# EAGLE design RTI-RoR (EAGLE 7.7.0)
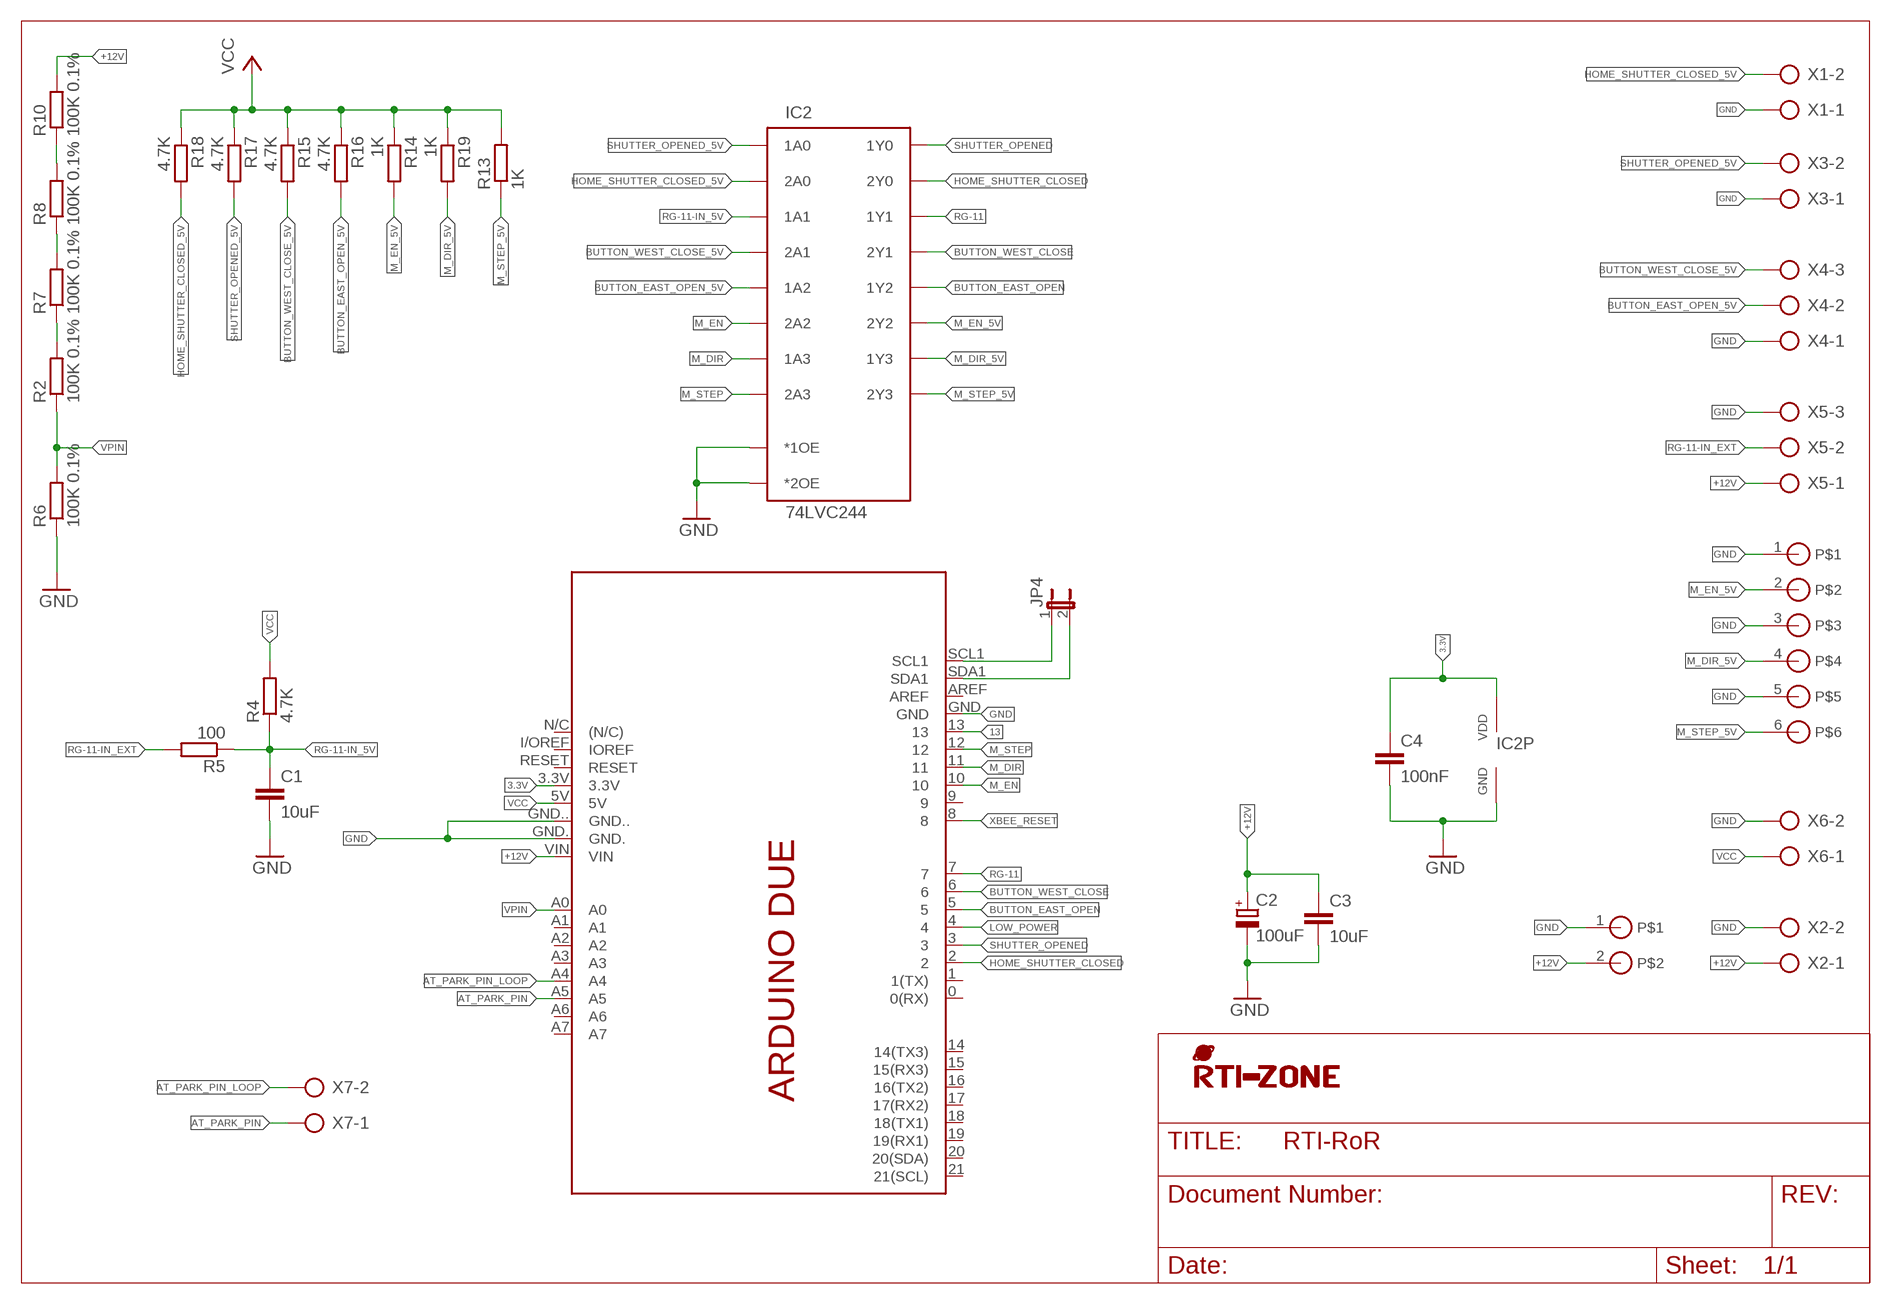
[diagram p0: schematic, sheet 1]

## Parts
C1  10uF  C-EU'0805'  [C0805]
C2  100uF  CPOL-EU  [UD-10X10_NICHICON]
C3  10uF  C-EU'0805'  [C0805]
C4  100nF  C-EU'0805'  [C0805]
IC2  74LVC244  [TSSOP20]
JP4  JP1E  [JP1]
PCB1  ARDUINO_DUE_SHIELD_SHORT  [ARDUINO_DUE_SHIELD_SHORT]
R2  100K 0.1%  R-EU'0805'  [R0805]
R4  4.7K  R-EU'0805'  [R0805]
R5  100  R-EU'0805'  [R0805]
R6  100K 0.1%  R-EU'0805'  [R0805]
R7  100K 0.1%  R-EU'0805'  [R0805]
R8  100K 0.1%  R-EU'0805'  [R0805]
R10  100K 0.1%  R-EU'0805'  [R0805]
R13  1K  R-EU'0805'  [R0805]
R14  1K  R-EU'0805'  [R0805]
R15  4.7K  R-EU'0805'  [R0805]
R16  4.7K  R-EU'0805'  [R0805]
R17  4.7K  R-EU'0805'  [R0805]
R18  4.7K  R-EU'0805'  [R0805]
R19  1K  R-EU'0805'  [R0805]
U$2  STL-140-2  [STL-140-2]
U$3  STL-140-6  [STL-140-6]
U$4  RTI-LOGO_BIG  [LOGO_BIG]
X1  AK500/2  [AK500/2]
X2  AK500/2  [AK500/2]
X3  AK500/2  [AK500/2]
X4  AK500/3  [AK500/3]
X5  AK500/3  [AK500/3]
X6  AK500/2  [AK500/2]
X7  AK500/2  [AK500/2]

## Nets
3.3V: C4.1 IC2.P$20(VDD) PCB1.3.3V
13: PCB1.13
+12V [+12V]: C2.+ C3.1 PCB1.VIN R10.2 U$2.2 X2.1 X5.1
AT_PARK_PIN: PCB1.A5 X7.1
AT_PARK_PIN_LOOP: PCB1.A4 X7.2
BUTTON_EAST_OPEN: IC2.P$14(1Y2) PCB1.5
BUTTON_EAST_OPEN_5V: IC2.P$6(1A2) R16.2 X4.2
BUTTON_WEST_CLOSE: IC2.P$5(2Y1) PCB1.6
BUTTON_WEST_CLOSE_5V: IC2.P$15(2A1) R15.2 X4.3
GND [GND]: C1.2 C2.- C3.2 C4.2 IC2.P$1(*1OE) IC2.P$10(GND) IC2.P$19(*2OE) PCB1.GND PCB1.GND. PCB1.GND.. R6.1 U$2.1 U$3.1 U$3.3 U$3.5 X1.1 X2.2 X3.1 X4.1 X5.3 X6.2
HOME_SHUTTER_CLOSED: IC2.P$3(2Y0) PCB1.2
HOME_SHUTTER_CLOSED_5V: IC2.P$17(2A0) R18.2 X1.2
LOW_POWER: PCB1.4
M_DIR: IC2.P$8(1A3) PCB1.11
M_DIR_5V: IC2.P$12(1Y3) R19.2 U$3.4
M_EN: IC2.P$13(2A2) PCB1.10
M_EN_5V: IC2.P$7(2Y2) R14.2 U$3.2
M_STEP: IC2.P$11(2A3) PCB1.12
M_STEP_5V: IC2.P$9(2Y3) R13.1 U$3.6
N$2: R7.2 R8.1
N$3: R8.2 R10.1
N$5: R2.2 R7.1
N$6: JP4.1 PCB1.SCL1
N$8: JP4.2 PCB1.SDA1
RG-11: IC2.P$16(1Y1) PCB1.7
RG-11-IN_5V: C1.1 IC2.P$4(1A1) R4.1 R5.1
RG-11-IN_EXT: R5.2 X5.2
SHUTTER_OPENED: IC2.P$18(1Y0) PCB1.3
SHUTTER_OPENED_5V: IC2.P$2(1A0) R17.2 X3.2
VCC: PCB1.5V R4.2 R13.2 R14.1 R15.1 R16.1 R17.1 R18.1 R19.1 X6.1
VPIN: PCB1.A0 R2.1 R6.2
XBEE_RESET: PCB1.8
Unconnected: PCB1.0(0(RX)) PCB1.1(1(TX)) PCB1.9 PCB1.14(14(TX3)) PCB1.15(15(RX3)) PCB1.16(16(TX2)) PCB1.17(17(RX2)) PCB1.18(18(TX1)) PCB1.19(19(RX1)) PCB1.20(20(SDA)) PCB1.21(21(SCL)) PCB1.A1 PCB1.A2 PCB1.A3 PCB1.A6 PCB1.A7 PCB1.AREF PCB1.I/OREF(IOREF) PCB1.N/C((N/C)) PCB1.RESET

## Library data of the parts
C1 C3 C4 = rti:C-EU
C2 = rti:CPOL-EU
IC2 = rti:74*244
JP4 = jumper:JP1E: JUMPER
PCB1 = arduino_shield:ARDUINO_DUE_SHIELD_SHORT: Device for representing an Arduino Due board with a footprint in an EAGLE design. Created by Dave Young for Element14. More EAGLE documentation at: http://www.element14.com/community/community/knode/cadsoft_eagle
R2 R4-R8 R10 R13-R19 = rti:R-EU
U$2 = rti:STL-140-2
U$3 = rti:STL-140-6
U$4 = rti:RTI-LOGO
X1-X3 X6 X7 = con-ptr500:AK500/2: CONNECTOR; OC_FARNELL: unknown; OC_NEWARK: unknown
X4 X5 = con-ptr500:AK500/3: CONNECTOR; OC_FARNELL: unknown; OC_NEWARK: unknown

## Net classes
0 default: width 0.254 mm, drill 0.3 mm, clearance 0.203 mm
1 +12V: width 0.254 mm, drill 0.3 mm, clearance 0.203 mm
2 GND: width 0.254 mm, drill 0.3 mm, clearance 0.203 mm

## Board
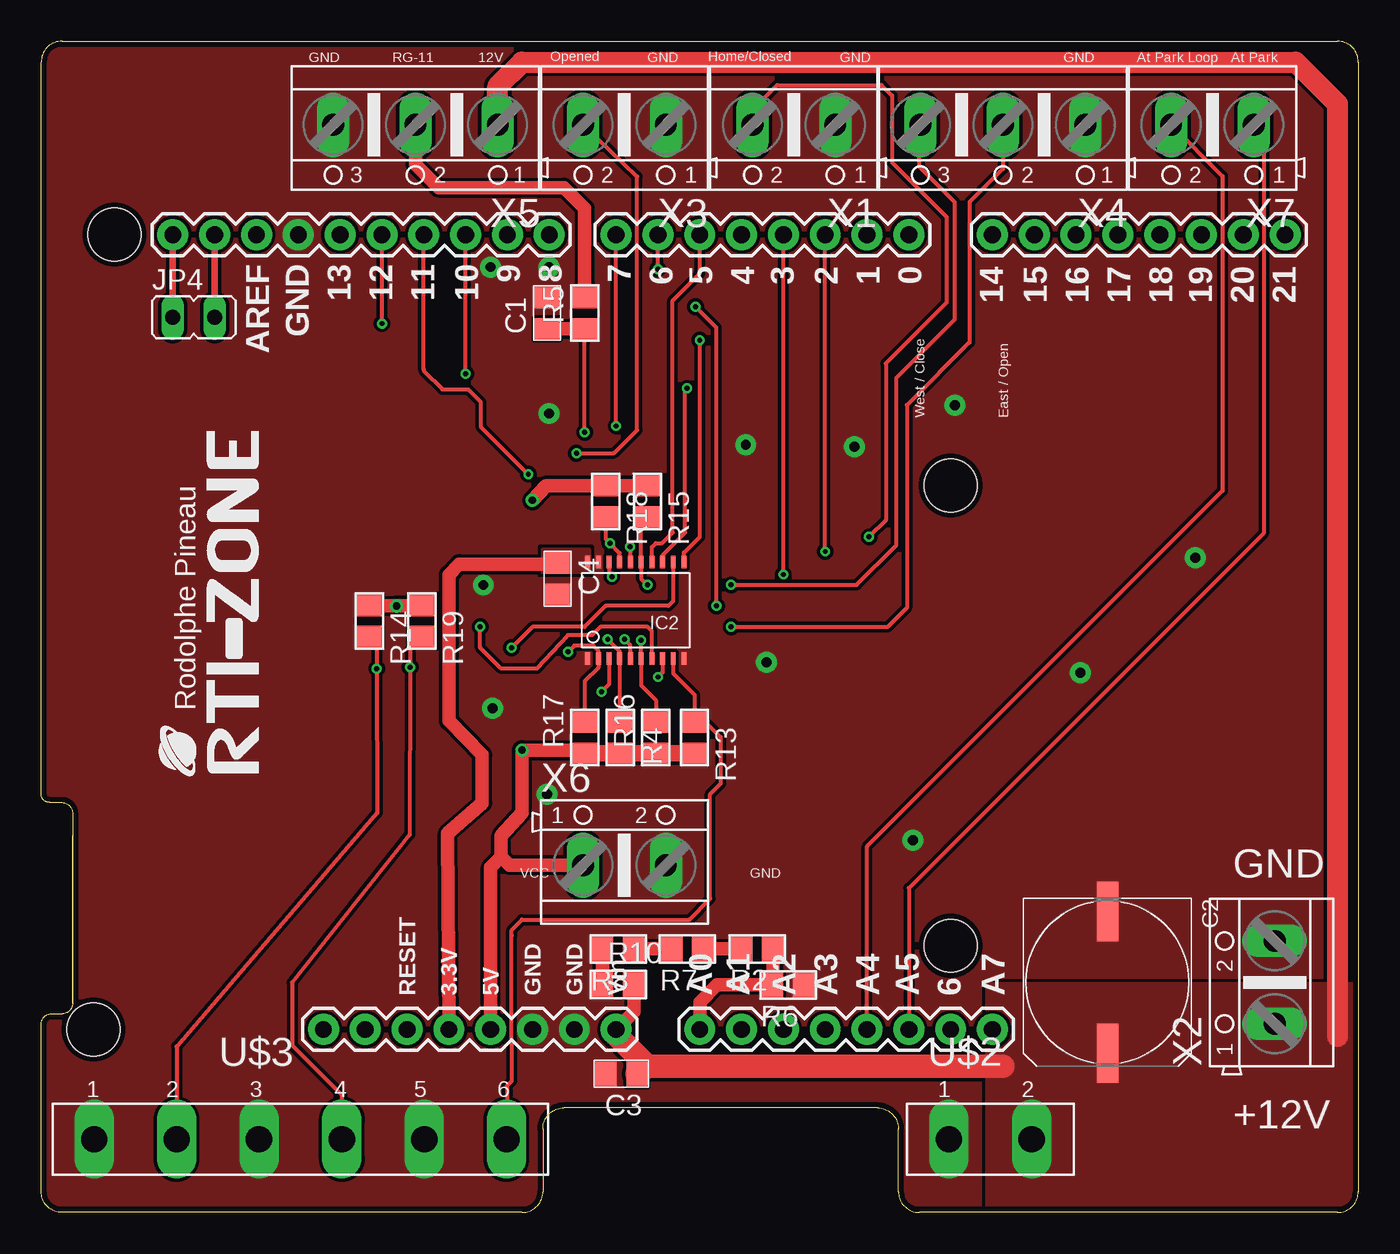
[diagram p1: board, top side]
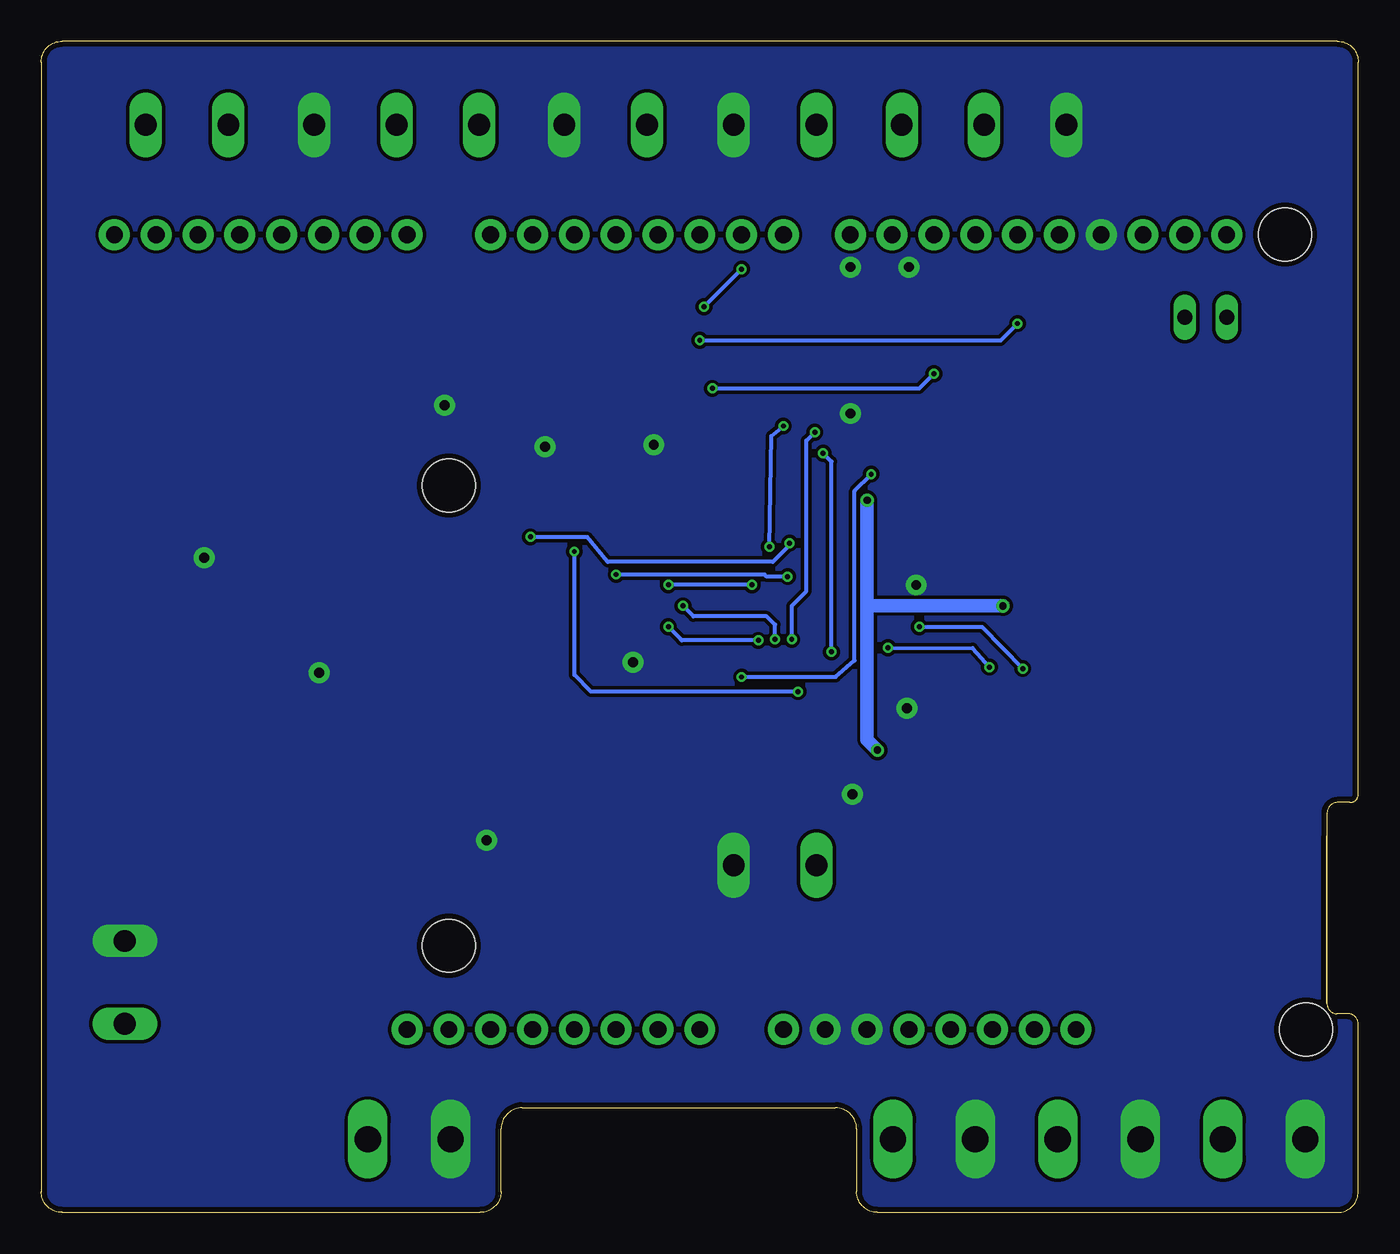
[diagram p2: board, bottom side, seen from below]

Size 80.01 x 71.12 mm. Coordinates in mm from the lower left corner, seen from the top.
Outline: 1.91,22.86 1.91,12.7
Outline: 1.91,12.7 1.91,22.86
Outline: 1.91,12.7 arc-90 1.3,12.06 0.64,12.06 arc90 0,11.43 0,1.27 arc90 1.27,0 29.21,0 arc90 30.48,1.27 30.48,5.08 arc-90 31.75,6.35 50.8,6.35 arc-90 52.07,5.08 52.07,1.27 arc90 53.34,0 78.74,0 arc90 80.01,1.27 80.01,69.85 arc90 78.74,71.12 1.27,71.12 arc90 0,69.85 0,25.4 arc90 0.51,24.89 1.27,24.89 arc-90 1.91,24.26 1.91,22.86
Copper layers (1*16): Top 0.07mm / dielectric 1.6mm / Bottom 0.07mm
Design rules "Fusion": minimum track width 8mil, minimum drill 0.3mm, track to track 8mil, track to pad 8mil, pad to pad 8mil, via to via 8mil, smd to smd 6mil, copper to edge 13mil, drill to drill 6mil, minimum pad ring 6mil, minimum via ring 6mil, stop-mask expansion 3mil, vias tented up to drill 130mil, thermal gap 8mil

### Footprints (pad centres in the part's own frame; a part is rotated, then mirrored left to right if it is on the bottom)
C0805 = smd 1.3 x 1.5: 1 -0.95,0; 2 0.95,0
UD-10X10_NICHICON = smd 3.6 x 1.3: + 4.3,0; - -4.3,0
TSSOP20 = smd 0.75 x 0.3: P$1 -3.19,3.635; P$2 -3.19,2.985; P$3 -3.19,2.335; P$4 -3.19,1.685; P$5 -3.19,1.035; P$6 -3.19,0.385; P$7 -3.19,-0.265; P$8 -3.19,-0.915; P$9 -3.19,-1.565; P$10 -3.19,-2.215; P$11 2.66,-2.215; P$12 2.66,-1.565; P$13 2.66,-0.915; P$14 2.66,-0.265; P$15 2.66,0.385; P$16 2.66,1.035; P$17 2.66,1.685; P$18 2.66,2.335; P$19 2.66,2.985; P$20 2.66,3.635
JP1 = drill 0.914 long: 1 0,-1.27; 2 0,1.27
ARDUINO_DUE_SHIELD_SHORT = drill 1.016 pad 1.88: 0 12.7,26.67; 1 10.16,26.67; 2 7.62,26.67; 3 5.08,26.67; 3.3V -15.24,-21.59; 4 2.54,26.67; 5 0,26.67; 5V -12.7,-21.59; 6 -2.54,26.67; 7 -5.08,26.67; 8 -9.144,26.67; 9 -11.684,26.67; 10 -14.224,26.67; 11 -16.764,26.67; 12 -19.304,26.67; 13 -21.844,26.67; 14 17.78,26.67; 15 20.32,26.67; 16 22.86,26.67; 17 25.4,26.67; 18 27.94,26.67; 19 30.48,26.67; 20 33.02,26.67; 21 35.56,26.67; A0 0,-21.59; A1 2.54,-21.59; A2 5.08,-21.59; A3 7.62,-21.59; A4 10.16,-21.59; A5 12.7,-21.59; A6 15.24,-21.59; A7 17.78,-21.59; AREF -26.924,26.67; GND -24.384,26.67; GND. -7.62,-21.59; GND.. -10.16,-21.59; I/OREF -20.32,-21.59; N/C -22.86,-21.59; RESET -17.78,-21.59; SCL1 -32.004,26.67; SDA1 -29.464,26.67; VIN -5.08,-21.59 | hole 3.2: -35.56,26.67; -36.83,-21.59; 15.24,11.43; 15.24,-16.51
R0805 = smd 1.3 x 1.5: 1 -0.95,0; 2 0.95,0
STL-140-2 = drill 1.6 long: 1 -2.515,0; 2 2.515,0
STL-140-6 = drill 1.6 long: 1 -12.522,0; 2 -7.518,0; 3 -2.515,0; 4 2.515,0; 5 7.518,0; 6 12.522,0
AK500/2 = drill 1.321 long: 1 -2.515,0; 2 2.515,0
AK500/3 = drill 1.321 long: 1 -5.004,0; 2 0,0; 3 5.004,0

### Placement (x,y rotation side)
C1  30.73,54.61 90 top
C2  64.77,13.97 270 top
C3  35.24,8.41 180 top
C4  31.37,38.48 270 top
IC2  36.83,36.83 90 top
JP4  9.27,54.36 270 top
PCB1  40.01,32.7 0 top
R2  43.5,16 180 top
R4  35.18,28.83 270 top
R5  33.02,54.61 90 top
R6  45.37,13.81 180 top
R7  39.24,16 180 top
R8  35.05,16 180 top
R10  35.05,13.84 0 top
R13  39.69,28.83 270 top
R14  19.94,35.91 270 top
R15  36.83,43.18 270 top
R16  37.34,28.83 90 top
R17  33.02,28.83 90 top
R18  34.29,43.18 270 top
R19  23.11,35.91 270 top
U$2  57.66,4.45 0 top
U$3  15.75,4.45 0 top
U$4  13.21,26.67 90 top
X1  45.72,66.04 180 top
X2  74.93,13.97 90 top
X3  35.43,66.04 180 top
X4  58.42,66.04 180 top
X5  22.73,66.04 180 top
X6  35.43,21.08 0 top
X7  71.15,66.04 180 top

### Tracks (layer width: path | path; a pad name or v marks a point on that pad's centre or on a via)
3.3V
  Top 0.406: 31.43,39.49 C4.1
  Top 0.813: C4.1 31.31,39.37 25.4,39.37 24.77,38.73 24.77,29.84 26.8,27.78 26.8,24.86 24.7,23.02 PCB1.3.3V
  pour Top (isolate 0.254, no thermals): 30.48,40.26 33.27,40.26 33.27,38.86 30.48,38.86
+12V
  Top 0.813: R10.2 36,12.19 PCB1.VIN
  Top 1.27: X5.1 27.74,68.38 29.21,69.85 76.2,69.85 78.74,67.31 78.74,34.29 78.74,10.67
  Top 1.422: PCB1.VIN 34.92,10.79 36.83,8.89 | 36.83,8.89 58.42,8.89 | C3.1 36.83,8.89
  pour Top (no thermals): 57.5,13.84 79.88,13.84 79.88,0 57.5,0
AT_PARK_PIN
  Top 0.254: X7.1 74.3,65.41 74.3,41.27 52.7,19.68 PCB1.A5
AT_PARK_PIN_LOOP
  Top 0.254: PCB1.A4 50.16,22.23 71.75,43.81 71.75,62.92 X7.2
BUTTON_EAST_OPEN
  Top 0.254: IC2.P$14 37.09,40.4 37.34,40.64 37.72,40.64 38.35,41.27 38.35,55.37 40.01,57.02 PCB1.5
BUTTON_EAST_OPEN_5V  (via drill 0.3)
  Top 0.254: v41.91,35.56 51.44,35.56 52.58,36.7 52.58,49.02 56.39,52.83 56.39,61.34 58.42,63.37 X4.2 | v36.45,34.73 IC2.P$6 36.45,32.01 37.34,31.11 R16.2
  Bottom 0.254: v41.91,35.56 41.15,34.8 41.08,34.73 v36.45,34.73
BUTTON_WEST_CLOSE  (via drill 0.3)
  Top 0.254: IC2.P$5 35.8,34.44 v35.43,34.8 | v41.02,36.83 41.02,53.72 v39.75,54.99 | v37.47,57.28 PCB1.6
  Bottom 0.254: v35.43,34.8 35.43,35.69 35.94,36.2 40.39,36.2 v41.02,36.83 | v39.75,54.99 v37.47,57.28
BUTTON_WEST_CLOSE_5V  (via drill 0.3)
  Top 0.254: v36.83,38.1 36.45,38.48 IC2.P$15 36.45,41.46 R15.2 | v41.91,38.1 49.53,38.1 51.94,40.51 51.94,50.67 55.5,54.23 55.5,61.34 53.34,63.5 53.34,65.96 X4.3
  Bottom 0.254: v36.83,38.1 v41.91,38.1
GND  (via drill 0.6 pad 1.27)
  other vias: 44.07,33.4 26.86,38.1 42.8,46.61 30.73,25.4 27.43,30.61 30.86,48.51 30.86,57.4 27.3,57.4 49.4,46.48 55.5,49.02 70.1,39.75 63.12,32.77 52.96,22.61
  pour Bottom (rank 2, no thermals): 0,0 0,71.12 80.01,71.12 80.01,0
  pour Top (rank 2, no thermals): 0,0 0,71.12 80.01,71.12 80.01,0
HOME_SHUTTER_CLOSED  (via drill 0.3)
  Top 0.254: IC2.P$3 34.49,32.08 v34.04,31.62 | v47.62,40.13 PCB1.2
  Bottom 0.254: v34.04,31.62 46.61,31.62 47.62,32.64 v47.62,40.13
HOME_SHUTTER_CLOSED_5V  (via drill 0.3)
  Top 0.254: IC2.P$17 35.15,40.04 v34.54,40.64 34.29,40.89 R18.2 | X1.2 43.2,66.95 44.7,68.45 51.05,68.45 51.69,67.82 51.69,63.75 54.99,60.45 54.99,55.24 51.31,51.56 51.31,42.04 v50.29,41.02
  Bottom 0.254: v34.54,40.64 34.54,40.51 35.56,39.5 45.59,39.5 46.86,41.02 v50.29,41.02
M_DIR  (via drill 0.3)
  Top 0.254: IC2.P$8 37.74,32.79 v37.47,32.51 | PCB1.11 23.24,51.18 23.24,51.12 24.38,49.97 25.94,49.97 26.7,49.21 26.7,47.72 v29.59,44.83
  Bottom 0.254: v37.47,32.51 31.75,32.51 30.61,33.53 30.61,43.81 v29.59,44.83
M_DIR_5V  (via drill 0.3)
  Top 0.254: IC2.P$12 38.4,37.12 38.1,36.83 34.29,36.83 33.02,35.56 29.84,35.56 v28.57,34.29 | R19.2 22.42,34.26 v22.42,33.12 22.38,22.95 15.24,13.97 15.24,10.16 18.26,7.14 U$3.4
  Bottom 0.254: v28.57,34.29 23.43,34.26 v22.42,33.12
M_EN  (via drill 0.3)
  Top 0.254: IC2.P$13 37.74,39.9 39.12,41.27 39.12,49.91 v39.24,50.04 | v25.78,50.93 PCB1.10
  Bottom 0.254: v39.24,50.04 26.67,50.04 v25.78,50.93
M_EN_5V  (via drill 0.3)
  Top 0.254: IC2.P$7 37.09,35.3 36.83,35.56 33.97,35.56 33.47,35.05 32,35.05 30.1,33.02 27.94,33.02 26.67,34.29 v26.67,35.56 | R14.2 20.38,34.52 v20.38,33.02 20.41,24.26 8.26,10.1 8.23,10.07 U$3.2
  Bottom 0.254: v26.67,35.56 22.86,35.56 v20.38,33.02
M_STEP  (via drill 0.3)
  Top 0.254: IC2.P$11 39.05,40.06 40.01,41.02 v40.01,52.96 | v20.7,53.98 PCB1.12
  Bottom 0.254: v40.01,52.96 21.72,52.96 v20.7,53.98
M_STEP_5V
  Top 0.254: IC2.P$9 38.4,32.73 39.69,31.43 R13.1 40.36,29.78 41.27,28.86 41.27,26.04 40.64,25.4 40.64,19.05 39.37,17.78 29.21,17.78 28.57,17.14 28.57,16.83 28.57,10.48 28.57,7.97 28.29,7.68 28.29,4.46 U$3.6
N$2
  Top 0.813: R8.1 R7.2
N$3
  Top 0.813: R10.1 R8.2
N$5
  Top 0.813: R7.1 R2.2
N$6
  Top 0.406: PCB1.SCL1 JP4.1
N$8
  Top 0.406: PCB1.SDA1 JP4.2
RG-11  (via drill 0.3)
  Top 0.254: IC2.P$16 35.8,40.41 v35.78,40.42 | v34.92,47.75 PCB1.7
  Bottom 0.254: v35.78,40.42 35.66,47.15 v34.92,47.75
RG-11-IN_5V  (via drill 0.3)
  Top 0.254: R4.1 35.15,29.81 IC2.P$4 35.15,34.07 v34.42,34.8 | v33.02,47.37 R5.1
  Top 0.813: C1.1 R5.1
  Bottom 0.254: v34.42,34.8 34.42,36.83 33.53,37.72 33.53,46.86 v33.02,47.37
RG-11-IN_EXT
  Top 0.813: X5.2 22.73,63.63 24.13,62.23 31.75,62.23 33.02,60.96 R5.2
SHUTTER_OPENED  (via drill 0.3)
  Top 0.254: IC2.P$18 34.49,38.78 v34.67,38.61 | v45.09,38.73 PCB1.3
  Bottom 0.254: v34.67,38.61 35.94,38.61 36.07,38.73 v45.09,38.73
SHUTTER_OPENED_5V  (via drill 0.3)
  Top 0.254: R17.2 33.02,32.26 33.84,33.08 IC2.P$2 33.84,34.1 33.53,34.42 32.38,34.42 v32,34.04 | v32.51,46.1 34.8,46.1 36.2,47.5 36.2,62.89 X3.2
  Bottom 0.254: v32,34.04 32,45.59 v32.51,46.1
VCC  (via drill 0.45 pad 0.81)
  Top 0.406: R19.1 23.09,36.83 | R14.1 19.97,36.83
  Top 0.813: PCB1.5V 27.3,20.95 27.94,21.59 | 27.94,21.59 27.94,22.86 29.21,24.26 v29.21,28.07 32.83,28.07 R17.1 | R15.1 R18.1 30.67,44.13 v29.84,43.24 | X6.1 28.45,21.08 27.94,21.59 | 23.09,36.83 v21.59,36.83 19.97,36.83
  Top 1.016: R17.1 R4.2 R16.1 R13.2
  Bottom 0.813: v29.84,43.24 29.84,36.83 | 29.84,36.83 29.84,28.7 v29.21,28.07 | v21.59,36.83 29.84,36.83
VPIN
  Top 0.813: R2.1 44.45,13.84 R6.2 41.05,13.81 40.01,12.76 PCB1.A0

### Text on the board
tPlace: GND | RG-11 | 12V | Opened | GND | Home/Closed | GND | GND | At Park Loop | At Park | West / Close | East / Open | VCC | GND | GND | +12V